# Altium schematic sheet Power.SchDoc
size A4; SheetNumber: 3; SheetTotal: 3
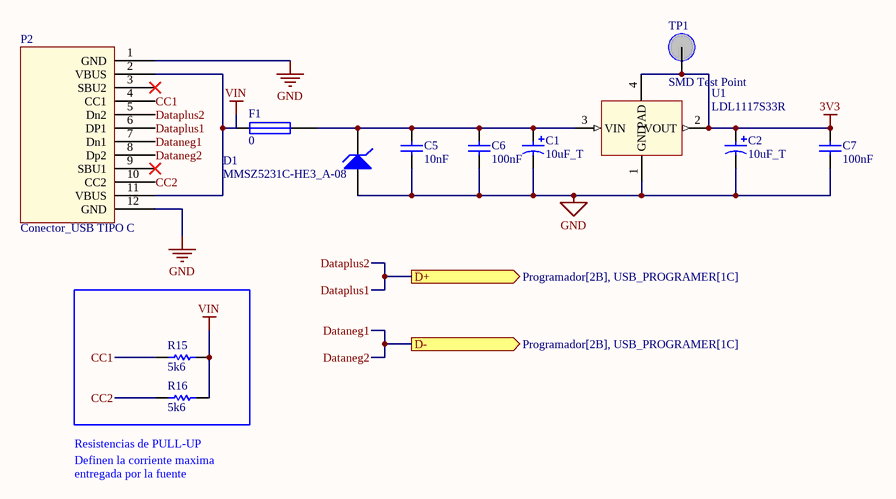
[diagram p0: Power.SchDoc]

## Parts
C1  10uF_T  [C_0805_2013_c]
C2  10uF_T  [C_0805_2013_c]
C5  10nF  [C_0805_2013_b]
C6  100nF  [C_0805_2013_b]
C7  100nF  [C_0805_2013_b]
D1  MMSZ5231C-HE3_A-08  [D_SOD-123]
F1  0  [F_0805_2012]
P2  Conector_USB TIPO C  [P_USB_C]
R15  5k6  [R_0805_2012_a]
R16  5k6  [R_0805_2012_a]
TP1  SMD Test Point  [TP SMD]
U1  LDL1117S33R  [U_SOT-223]

## Ports
D+ (out, see Programador[2B], USB_PROGRAMER[1C]), D- (out, see Programador[2B], USB_PROGRAMER[1C])

## Nets
3V3: C2.1 C7.2 TP1.1 U1.2(VOUT) U1.4(PAD)
GND: C1.2 C2.2 C5.1 C6.1 C7.1 D1.2(A) P2.1(GND) P2.12(GND) U1.1(GND)
VIN: F1.1 P2.2(VBUS) P2.11(VBUS) R15.1 R16.2
CC1: P2.4(CC1) R15.2
CC2: P2.10(CC2) R16.1
Dataneg1: P2.7(Dn1) P2.8(Dp2) ; port D-  [also labelled Dataneg2]
Dataplus1: P2.5(Dn2) P2.6(DP1) ; port D+  [also labelled Dataplus2]
NetC1_1: C1.1 C5.2 C6.2 D1.1(K) F1.2 U1.3(VIN)

Not connected (* = marked no-connect by the designer): P2 3(SBU2)* 9(SBU1)*

## Notes on the sheet
- (near R16) Resistencias de PULL-UP
- Definen la corriente maxima entregada por la fuente

## Library data of the parts
C1 C2 = C_10uF_10V_b: Capacitor SMD 0805 Tant; Manufacturer: Vishay; Manufacturer Part Number: TMCP1A106MTRF; RoHS Compliant: Yes; Supplier 1: Mouser; Supplier Part Number 1: 74-TMCP1A106MTRF; RoHS: Yes; Category: Tantalum Capacitors; Stock 1: 7293; Pricing 1: 1=0,3, 10=0,152, 50=0,152, 100=0,098, 1000=0,082, 10000=0,067 (USD); Value: 10uF_T
C5 = C_10nF_50V_b: Capacitor SMD 0805; Manufacturer: KEMET; Manufacturer Part Number: C0805C103J5RAC7210; Dielectric Material: Ceramic; Tolerance: 5%; Voltage Rating: 50V; Dielectric: X7R; Case/Package: 0805; Case Code (Imperial): 0805; Case Code (Metric): 2012; Min Operating Temperature: -55°C; Max Operating Temperature: 125°C; Packaging: Tape and Reel; Package Quantity: 10000; Voltage Rating (DC): 50V; Termination: SMD/SMT; Series: SMD Comm X7R; Length: 2mm; Lead Pitch: 0.75mm; Depth: 1.25mm; RoHS Compliant: Yes; ComponentLink1URL: http://www.mouser.com/ds/2/212/KEM_C1002_X7R_SMD-1102033.pdf?src-supplier=Mouser; ComponentLink1Description: http://www.mouser.com/ds/2/212/KEM_C1002_X7R_SMD-1102033.pdf?src-supplier=Mouser; ComponentLink2URL: http://components.arrow.com/part/dataview/3450688S9650973N7429?src-supplier=Arrow+Electronics; ComponentLink2Description: http://components.arrow.com/part/dataview/3450688S9650973N7429?src-supplier=Arrow+Electronics; ComponentLink3URL: https://datasheet.octopart.com/C0805C103J5RAC7210-KEMET-datasheet-68331906.pdf?src-supplier=Farnell; ComponentLink3Description: https://datasheet.octopart.com/C0805C103J5RAC7210-KEMET-datasheet-68331906.pdf?src-supplier=Farnell; ComponentLink4URL: https://api.kemet.com/component-edge/download/datasheet/C0805C103J5RAC7210.pdf?src-supplier=Digikey; ComponentLink4Description: https://api.kemet.com/component-edge/download/datasheet/C0805C103J5RAC7210.pdf?src-supplier=Digikey; ComponentLink5URL: https://datasheet.octopart.com/C0805C103J5RAC7210-KEMET-datasheet-37550250.pdf?src-supplier=Electro+Sonic; ComponentLink5Description: https://datasheet.octopart.com/C0805C103J5RAC7210-KEMET-datasheet-37550250.pdf?src-supplier=Electro+Sonic; ComponentLink6URL: https://datasheet.octopart.com/C0805C103J5RAC7210-KEMET-datasheet-166547538.pdf?src-supplier=TME; ComponentLink6Description: https://datasheet.octopart.com/C0805C103J5RAC7210-KEMET-datasheet-166547538.pdf?src-supplier=TME; Supplier 1: Mouser; Supplier Part Number 1: 80-C0805C103J5R7210; RoHS: Yes; Category: Ceramic Capacitors; Stock 1: 30128; Pricing 1: 1=0,1, 10=0,034, 50=0,034, 100=0,02, 1000=0,014, 10000=0,009 (USD); Value: 10nF
C6 C7 = C_100nF_50V_b: Capacitor SMD 0805; Manufacturer: Yageo; Manufacturer Part Number: CC0805KRX7R9BB104; Material: Ceramic; Tolerance: 10%; Dielectric: X7R; Voltage: 50V; Insulation Resistance: 100GR; Mounting Technology: Surface Mount; Case/Package: 0805; Pins: 2; Case Code (Metric): 2012; Case Code (Imperial): 0805; Min Operating Temperature: -55°C; Max Operating Temperature: 125°C; Packaging: Tape and Reel; Voltage Rating: 50V; Package Quantity: 4000; Termination: SMD/SMT; Series: CC; Length: 2mm; Height: 0.85mm; Depth: 1.25mm; Radiation Hardening: No; RoHS Compliant: Yes; Reach SVHC Compliant: No; Halogen Free: 5694HalogenFree; Lead Free: 5697LeadFree; ComponentLink1URL: https://datasheet.ciiva.com/11786/0900766b80d84f1d-11786009.pdf?src-supplier=Rs; ComponentLink1Description: https://datasheet.ciiva.com/11786/0900766b80d84f1d-11786009.pdf?src-supplier=Rs; ComponentLink2URL: https://datasheet.ciiva.com/46393/1734573-46393307.pdf?src-supplier=Element14; ComponentLink2Description: https://datasheet.ciiva.com/46393/1734573-46393307.pdf?src-supplier=Element14; ComponentLink3URL: https://datasheet.ciiva.com/155/mlccorderingcode-155930.pdf?src-supplier=Digikey; ComponentLink3Description: https://datasheet.ciiva.com/155/mlccorderingcode-155930.pdf?src-supplier=Digikey; ComponentLink4URL: https://datasheet.ciiva.com/155/mlccorderingcode-155929.pdf?src-supplier=Digikey; ComponentLink4Description: https://datasheet.ciiva.com/155/mlccorderingcode-155929.pdf?src-supplier=Digikey; ComponentLink5URL: https://datasheet.ciiva.com/155/mlccorderingcode-155931.pdf?src-supplier=Digikey; ComponentLink5Description: https://datasheet.ciiva.com/155/mlccorderingcode-155931.pdf?src-supplier=Digikey; ComponentLink6URL: https://datasheet.ciiva.com/11464/upy-gphc-x7r-6-3v-to-50v-8-11464757.pdf?src-supplier=Avnet; ComponentLink6Description: https://datasheet.ciiva.com/11464/upy-gphc-x7r-6-3v-to-50v-8-11464757.pdf?src-supplier=Avnet; ComponentLink7URL: https://datasheet.ciiva.com/28450/1489800-28450805.pdf?src-supplier=Element14; ComponentLink7Description: https://datasheet.ciiva.com/28450/1489800-28450805.pdf?src-supplier=Element14; ComponentLink8URL: https://datasheet.ciiva.com/29242/445210-da-01-en-kerko-chip-0805-x7r-0-1uf-10proz-50vg-29242074.pdf?src-supplier=Conrad; ComponentLink8Description: https://datasheet.ciiva.com/29242/445210-da-01-en-kerko-chip-0805-x7r-0-1uf-10proz-50vg-29242074.pdf?src-supplier=Conrad; Supplier 1: Digikey; Supplier Part Number 1: 311-1140-1-ND; RoHS: Yes; Category: Ceramic Capacitors; Stock 1: 5306374; Pricing 1: 1=0,1, 10=0,07, 50=0,0418, 100=0,0329, 500=0,02428, 1000=0,0201 (USD); Value: 100nF
D1 = D_MMSZ5231C-HE3_A-08: Diode SMD SOD-123 Zener 5V1; Manufacturer: Vishay Semiconductors; Manufacturer Part Number: MMSZ5226C-E3-08; Zener Voltage: 3.3V; Max Power Dissipation: 500mW; Impedance: 28R; Zener Current: 20mA; Voltage Tolerance: 2%; Max Reverse Leakage Current: 25uA; Mounting Technology: Surface Mount; Weight: 0.000363oz; Min Operating Temperature: -55°C; Max Operating Temperature: 150°C; Packaging: Tape and Reel; Package Quantity: 3000; Power Dissipation: 500mW; Tolerance: 2%; Series: Automotive, AEC-Q101; RoHS Compliant: Yes; ComponentLink1URL: https://www.vishay.com/docs/86344/mmsz5225_to_mmsz5267.pdf; ComponentLink1Description: Datasheet; RoHS: Yes; Category: Zener Diodes; Stock 1: 14347; Pricing 1: 1=0,29, 10=0,198, 50=0,198, 100=0,089, 1000=0,062, 10000=0,041 (USD); Value: MMSZ5231C-HE3_A-08; Supplier 1: Mouser; Supplier Part Number 1: 78-MMSZ5231CHE3_A-08
F1 = F_?_0805: (Generico) Fuse SMD 0805; Origin: TAIWAN; Published: 8-Jun-2000; LatestRevisionDate: 17-Jul-2002; LatestRevisionNote: Re-released for DXP Platform.; PackageReference: PIN-W2/E2.8; Publisher: Altium Limited; PackageDescription: Thru-Hole; 2 Leads; Supplier 1: Digi-Key; Supplier Part Number 1: SF-1206S200-2CT-ND; Value: 0
P2 = P_USB_C: Conector USB tip C basico; Value: Conector_USB TIPO C; Supplier 1: Mouser; Supplier Part Number 1: 179-UJ20CHGSMT1P16TR
R15 R16 = R_5k6_b: Resistor SMD 0805; Manufacturer: TE Connectivity; Manufacturer Part Number: CRG0805F5K6; Tolerance: 1%; Temperature Coefficient: 100ppm/°C; Power Rating: 125mW; Voltage Rating: 150V; Number of Resistors: 1; Mounting Technology: Surface Mount; Case/Package: 0805; Case Code (Imperial): 0805; Case Code (Metric): 2012; Min Operating Temperature: -55°C; Max Operating Temperature: 125°C; Packaging: Tape and Reel; Number of Terminations: 2; Series: CRG; Resistor Type: Thick Film; Termination: Solder; Technology: THICK FILM; Length: 2mm; Width: 1.25mm; Height: 0.55mm; Depth: 1.25mm; RoHS Compliant: Yes; ELV: Compliant; ComponentLink1URL: https://datasheet.ciiva.com/11809/0900766b800a696e-11809932.pdf?src-supplier=Rs; ComponentLink1Description: https://datasheet.ciiva.com/11809/0900766b800a696e-11809932.pdf?src-supplier=Rs; ComponentLink2URL: https://datasheet.ciiva.com/12563/eng-ds-1773204-g-12563327.pdf?src-supplier=Mouser; ComponentLink2Description: https://datasheet.ciiva.com/12563/eng-ds-1773204-g-12563327.pdf?src-supplier=Mouser; Supplier 1: Digikey; Supplier Part Number 1: A126380CT-ND; RoHS: Yes; Stock 1: 44154; Pricing 1: 1=0,1, 10=0,034, 50=0,0218, 100=0,0182, 500=0,01264, 1000=0,01093 (USD); Value: 5k6
TP1 = P_T_TP: Test Point SMD; Origin: CHINA; Published: 8-Jun-2000; LatestRevisionDate: 17-Jul-2002; LatestRevisionNote: Re-released for DXP Platform.; PackageReference: AXIAL-0.3; Publisher: Altium Limited; PackageDescription: Axial Device, Thru-Hole; 2 Leads; 0.3 in Pin Spacing; Supplier 1: Mouser; Supplier Part Number 1: 279-RCT-0C; Type: CONNECTOR; Value: SMD Test Point
U1 = U_LDL1117: LDL1117 Series 1.2 A 2.5 V High PSRR LDO Linear Voltage Regulator-SOT-223; Manufacturer: STMicroelectronics; Manufacturer Part Number: LDL1117S25R; Output Type: Fixed; Output Configuration: Positive; Number of Regulators: 1; Max Supply Voltage: 18V; Min Output Voltage: 2.5V; Output Current: 1.2A; Quiescent Current: 500uA; Power Supply Rejection Ratio (PSRR): 65dB; Accuracy: 2%; Min Supply Voltage: 2.6V; Nominal Supply Current: 250uA; Number of Channels: 1NUMBER; Value: LDL1117S25R; Mounting Technology: Surface Mount; Case/Package: TO-261-4; Min Operating Temperature: -40°C; Max Operating Temperature: 125°C; Packaging: Cut Tape; Series: -; Number of Outputs: 1NUMBER; Output Voltage: 2.5V; Height: 1.8mm; RoHS Compliant: Yes; ComponentLink1URL: http://www.farnell.com/datasheets/2342741.pdf?src-supplier=Farnell; ComponentLink1Description: http://www.farnell.com/datasheets/2342741.pdf?src-supplier=Farnell; ComponentLink2URL: http://www.st.com/content/ccc/resource/technical/document/datasheet/group3/0e/5a/00/ca/10/1a/4f/a5/DM00366442/files/DM00366442.pdf/jcr:content/translations/en.DM00366442.pdf?src-supplier=Digikey; ComponentLink2Description: http://www.st.com/content/ccc/resource/technical/document/datasheet/group3/0e/5a/00/ca/10/1a/4f/a5/DM00366442/files/DM00366442.pdf/jcr:content/translations/en.DM00366442.pdf?src-supplier=Digikey; ComponentLink3URL: https://datasheet.octopart.com/LDL1117S25R-STMicroelectronics-datasheet-165583407.pdf?src-supplier=TME; ComponentLink3Description: https://datasheet.octopart.com/LDL1117S25R-STMicroelectronics-datasheet-165583407.pdf?src-supplier=TME; Supplier 1: Mouser; Supplier Part Number 1: 511-LDL1117S25R; RoHS: Yes; Category: Voltage Regulators - Linear; Stock 1: 10345; Pricing 1: 1=1,1, 10=0,98, 50=0,935, 100=0,757, 1000=0,478, 10000=0,415 (USD)